# Altium schematic sheet Support.SchDoc: Support
size Letter; DrawnBy: Qinyang Bao, Ayesha Ebrahim, Nicole Rosario; Organization: UW Robotics; Address1: 200 University Avenue; Address2: Waterloo; Address3: Ontario; Address4: Canada N2L 3G6
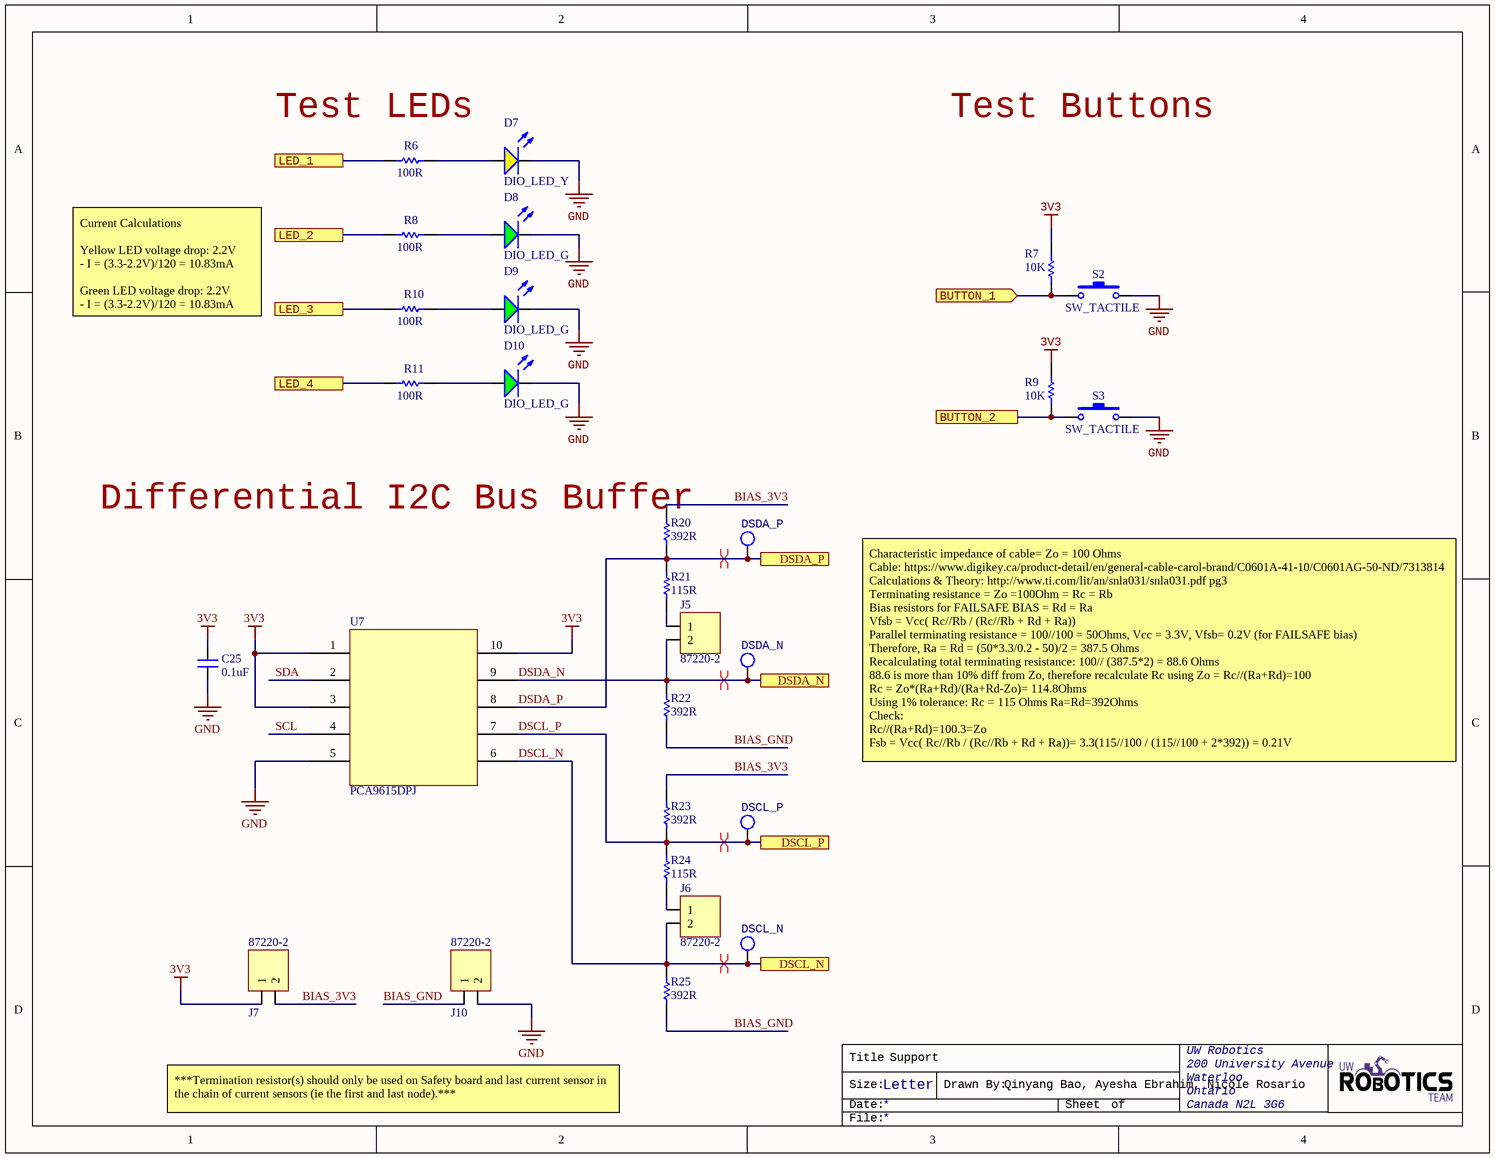
[diagram p0: Support.SchDoc]

## Parts
C25  value 0.1uF  [CAPC2012X140N]  (hidden comment: CAP_0.1uF_50V_0805)
D7  DIO_LED_Y  [LED_0805_LINE]
D8  DIO_LED_G  [LED_0805_LINE]
D9  DIO_LED_G  [LED_0805_LINE]
D10  DIO_LED_G  [LED_0805_LINE]
J5  Manufacturer Part Number 1: 87220-2  [HDR1X2]  (hidden comment: JUMPER_2)
J6  Manufacturer Part Number 1: 87220-2  [HDR1X2]  (hidden comment: JUMPER_2)
J7  Manufacturer Part Number 1: 87220-2  [HDR1X2]  (hidden comment: JUMPER_2)
J10  Manufacturer Part Number 1: 87220-2  [HDR1X2]  (hidden comment: JUMPER_2)
R6  value 100R  [RESC0603(1608)_N]  (hidden comment: RES_100R_0603)
R7  value 10K  [RESC0603(1608)_N]  (hidden comment: RES_10K_0603)
R8  value 100R  [RESC0603(1608)_N]  (hidden comment: RES_100R_0603)
R9  value 10K  [RESC0603(1608)_N]  (hidden comment: RES_10K_0603)
R10  value 100R  [RESC0603(1608)_N]  (hidden comment: RES_100R_0603)
R11  value 100R  [RESC0603(1608)_N]  (hidden comment: RES_100R_0603)
R20  Resistance: 392R  [RESC2012X60N]  (hidden comment: RES_392R_0805)
R21  Resistance: 115R  [RESC2012X60N]  (hidden comment: RES_115R_0805)
R22  Resistance: 392R  [RESC2012X60N]  (hidden comment: RES_392R_0805)
R23  Resistance: 392R  [RESC2012X60N]  (hidden comment: RES_392R_0805)
R24  Resistance: 115R  [RESC2012X60N]  (hidden comment: RES_115R_0805)
R25  Resistance: 392R  [RESC2012X60N]  (hidden comment: RES_392R_0805)
S2  SW_TACTILE  [B3U-1100P]
S3  SW_TACTILE  [B3U-1100P]
TP1  DSDA_P  [TESTPOINT_LOOP]
TP2  DSDA_N  [TESTPOINT_LOOP]
TP3  DSCL_P  [TESTPOINT_LOOP]
TP4  DSCL_N  [TESTPOINT_LOOP]
U7  DIFF_I2C_BUFFER  [PCA9615DPJ]  (value not drawn)

## Ports
BUTTON_1 (in), BUTTON_2, DSCL_N, DSCL_P, DSDA_N, DSDA_P, LED_1, LED_2, LED_3, LED_4

## Nets
3V3: C25.2 J7.1 R7.1 R9.2 U7.1(VDDA) U7.3(EN) U7.10(VDDB)
GND: C25.1 D7.2(K) D8.2(K) D9.2(K) D10.2(K) J10.2 S2.2 S3.2 U7.5(VSS)
BIAS_3V3: J7.2 R20.2 R23.2
BIAS_GND: J10.1 R22.1 R25.1
BUTTON_1: R7.2 S2.1 ; port BUTTON_1
BUTTON_2: R9.1 S3.1 ; port BUTTON_2
DSCL_N: J6.2 R25.2 TP4.1 U7.6(DSCLM) ; port DSCL_N
DSCL_P: R23.1 R24.2 TP3.1 U7.7(DSCLP) ; port DSCL_P
DSDA_N: J5.2 R22.2 TP2.1 U7.9(DSDAM) ; port DSDA_N
DSDA_P: R20.1 R21.2 TP1.1 U7.8(DSDAP) ; port DSDA_P
LED_1: R6.1 ; port LED_1
LED_2: R8.1 ; port LED_2
LED_3: R10.1 ; port LED_3
LED_4: R11.1 ; port LED_4
SCL: U7.4(SCL)
SDA: U7.2(SDA)
NetD7_1: D7.1(A) R6.2
NetD8_1: D8.1(A) R8.2
NetD9_1: D9.1(A) R10.2
NetD10_1: D10.1(A) R11.2
NetJ5_1: J5.1 R21.1
NetJ6_1: J6.1 R24.1

## Layout directives
differential pair: DSCL_N, DSCL_P, DSDA_N, DSDA_P

## Notes on the sheet
- (near R6) Test LEDs
- Test Buttons
- Current Calculations
  Yellow LED voltage drop: 2.2V
  - I = (3.3-2.2V)/120 = 10.83mA
  Green LED voltage drop: 2.2V
  - I = (3.3-2.2V)/120 = 10.83mA
- Differential I2C Bus Buffer
- Characteristic impedance of cable= Zo = 100 Ohms
  Cable: https://www.digikey.ca/product-detail/en/general-cable-carol-brand/C0601A-41-10/C0601AG-50-ND/7313814
  Calculations & Theory: http://www.ti.com/lit/an/snla031/snla031.pdf pg3
  Terminating resistance = Zo =100Ohm = Rc = Rb
  Bias resistors for FAILSAFE BIAS = Rd = Ra
  Vfsb = Vcc( Rc//Rb / (Rc//Rb + Rd + Ra))
  Parallel terminating resistance = 100//100 = 50Ohms, Vcc = 3.3V, Vfsb= 0.2V (for FAILSAFE bias)
  Therefore, Ra = Rd = (50*3.3/0.2 - 50)/2 = 387.5 Ohms
  Recalculating total terminating resistance: 100// (387.5*2) = 88.6 Ohms
  88.6 is more than 10% diff from Zo, therefore recalculate Rc using Zo = Rc//(Ra+Rd)=100
  Rc = Zo*(Ra+Rd)/(Ra+Rd-Zo)= 114.8Ohms
  Using 1% tolerance: Rc = 115 Ohms Ra=Rd=392Ohms
  Check:
  Rc//(Ra+Rd)=100.3=Zo
  Fsb = Vcc( Rc//Rb / (Rc//Rb + Rd + Ra))= 3.3(115//100 / (115//100 + 2*392)) = 0.21V
- ***Termination resistor(s) should only be used on Safety board and last current sensor in the chain of current sensors (ie the first and last node).***
- Title
- Size:
- Date:
- Letter
- Drawn By:
- Sheet
- of
- File:

## Library data of the parts
C25 = CAP_0.1uF_50V_0805: CAP CER 0.1UF 50V X7R 0805; Manufacturer 1: Murata; Manufacturer Part Number 1: GCD21BR71H104KA01L; Capacitance: 100nF; Tolerance: 10%; Supplier 1: Digi-Key; Mount: Surface Mount; Case/Package: 0805; Case Code (Metric): 2012; Case Code (Imperial): 0805; Min Operating Temperature: -55°C; Max Operating Temperature: 125°C; Voltage Rating: 50V; Dielectric: X7R; Termination: SMD/SMT; Length: 2mm; Height: 1.25mm; Width: 0.049inch; Thickness: 0.049inch; Depth: 1.25mm; Ratings: AEC-Q200; ComponentLink1URL: https://datasheet.ciiva.com/29537/c03e-29537701.pdf?src-supplier=Digi-Key; ComponentLink1Description: https://datasheet.ciiva.com/29537/c03e-29537701.pdf?src-supplier=Digi-Key; Supplier Part Number 1: 490-11955-1-ND
D7 = DIO_LED_Y: LED YELLOW DIFFUSED 0805 SMD; Manufacturer: OSRAM; MPN: LY R976-PS-36; Forward Voltage Drop: 2.2V; Package: 0805 (2012 Metric); Supplier Part Number 1: 475-2560-1-ND; Supplier 1: Digi-Key
D8-D10 = DIO_LED_G: LED GREEN DIFFUSED 0805 SMD; Manufacturer: OSRAM; MPN: LG R971-KN-1; Forward Voltage Drop: 2.2V; Package: 0805 (2012 Metric); Supplier Part Number 1: 475-1410-1-ND; Supplier 1: Digi-Key
J5-J7 J10 = JUMPER_2: HEADER 2X1; Manufacturer 1: TE Connectivity; Supplier 1: Digi-Key; Supplier Part Number 1: A26542-ND; Mount: Through Hole
R6 R8 R10 R11 = RES_100R_0603: RES SMD 100 OHM 1% 1/10W 0603; Manufacturer: Yageo; MPN: RC0603FR-07100RL; Package: 0603 (1608 Metric); Dimensions: 0.063" L x 0.031" W (1.60mm x 0.80mm); Tolerance: 1%; Supplier Part Number 1: 311-100HRCT-ND; Supplier 1: Digi-Key
R7 R9 = RES_10K_0603: RES SMD 10K OHM 5% 1/10W 0603; Manufacturer: Yageo; MPN: RC0603JR-0710KL; Package: 0603 (1608 Metric); Dimensions: 0.063" L x 0.031" W (1.60mm x 0.80mm); Tolerance: 5%; Supplier Part Number 1: 311-10KGRCT-ND; Supplier 1: Digi-Key
R20 R22 R23 R25 = RES_392R_0805: RES SMD 392 OHM 1% 1/8W 0805; Manufacturer 1: Yageo; Manufacturer Part Number 1: RC0805FR-07392RL; Max Power Dissipation: 125mW; Temperature Coefficient: 100ppm/°C; Voltage Rating (DC): 150V; Case Code (Imperial): 0805; Case Code (Metric): 2012; Case/Package: 0805; Category: Chip SMD Resistors; Composition: Thick Film; Depth: 1.25mm; Features: Moisture Resistant; Height: 0.024inch; Military Standard: Not; Max Operating Temperature: 155°C; Manufacturer Part Number: RC0805FR-07392RL; Length: 0.079inch; Lead Free: Lead Free; Min Operating Temperature: -55°C; Number of Terminations: 2; Package Quantity: 1; Packaging: Tape and Reel; Power Rating: 125mW; Tolerance: 1%; Width: 0.049inch; Supplier 1: Digi-Key; Supplier Part Number 1: 311-392CRCT-ND; Supplier Packaging 1: Cut Tape; Supplier Unit Price 1: 0.15 CAD; Supplier Location 1: US
R21 R24 = RES_115R_0805: RES SMD 115 OHM 1% 1/8W 0805; Manufacturer 1: Yageo; Manufacturer Part Number 1: RC0805FR-07115RL; Max Power Dissipation: 125mW; Temperature Coefficient: 100ppm/°C; Voltage Rating (DC): 150V; Case Code (Imperial): 0805; Case Code (Metric): 2012; Case/Package: 0805; Category: Chip SMD Resistors; Composition: Thick Film; Depth: 1.25mm; Features: Moisture Resistant; Height: 0.024inch; Military Standard: Not; Max Operating Temperature: 155°C; Manufacturer Part Number: RC0805FR-07115RL; Length: 0.079inch; Lead Free: Lead Free; Min Operating Temperature: -55°C; Number of Terminations: 2; Package Quantity: 1; Packaging: Tape and Reel; Power Rating: 125mW; Tolerance: 1%; Width: 0.049inch; Supplier 1: Digi-Key; Supplier Part Number 1: 311-115CRCT-ND; Supplier Packaging 1: Cut Tape; Supplier Unit Price 1: 0.14476 CAD; Supplier Location 1: US
S2 S3 = SW_TACTILE: Tactile Switch (Grey); Manufacturer: Omron Electronics Inc-EMC Div; MPN: B3U-1100P; Supplier 1: Digi-Key
  S3: Supplier Part Number 1: SW1021CT-ND
TP1-TP4 = TESTPOINT_LOOP: Loop testpoint through-hole pad; Manufacturer 1: Keystone Electronics; Manufacturer Part Number 1: 5002; Supplier Part Number 1: 36-5002-ND; Supplier 1: Digi-Key; Mount: Through Hole
U7 = DIFF_I2C_BUFFER: IC DIFF I2C BUFFER 2CH 10TSSOP; Manufacturer 1: NXP Semiconductors; Number of Channels: 2; Operating Supply Current: 16uA; Input: 2-Wire Bus; Max Frequency: 1MHz; Supplier 1: Digi-Key; Stock 1: 4899; Pricing 1: 1=2.95000, 10=2.64900, 100=2.05930, 500=1.78100, 1000=1.48045 (USD); RoHS: Yes; Case/Package: 10-TSSOP; Number of Pins: 10; Min Operating Temperature: -40°C; Max Operating Temperature: 85°C; Packaging: Cut Tape; Package Quantity: 1; ComponentLink1URL: http://www.farnell.com/datasheets/2340284.pdf?src-supplier=Farnell; ComponentLink1Description: http://www.farnell.com/datasheets/2340284.pdf?src-supplier=Farnell; ComponentLink2URL: http://www.mouser.com/ds/2/302/PCA9615-841773.pdf?src-supplier=Mouser; ComponentLink2Description: http://www.mouser.com/ds/2/302/PCA9615-841773.pdf?src-supplier=Mouser; ComponentLink3URL: http://components.arrow.com/part/dataview/65281105S797392N7788?src-supplier=Arrow; ComponentLink3Description: http://components.arrow.com/part/dataview/65281105S797392N7788?src-supplier=Arrow; ComponentLink4URL: http://www.nxp.com/documents/data_sheet/PCA9615.pdf?src-supplier=Avnet; ComponentLink4Description: http://www.nxp.com/documents/data_sheet/PCA9615.pdf?src-supplier=Avnet; ComponentLink5Description: Digikey Link; ComponentLink5URL: https://www.digikey.ca/products/en/integrated-circuits-ics/interface-signal-buffers-repeaters-splitters/756?k=PCA9615&k=&pkeyword=PCA9615&sv=0&pv7=2&sf=0&FV=-8%7C756&quantity=&ColumnSort=0&page=1&pageSize=25; Supplier Part Number 1: 568-11484-1-ND; Mount: Surface Mount; Manufacturer Part Number 1: PCA9615DPJ